# Altium schematic sheet doantk.SchDoc
size A2; SheetNumber: 1; SheetTotal: 1
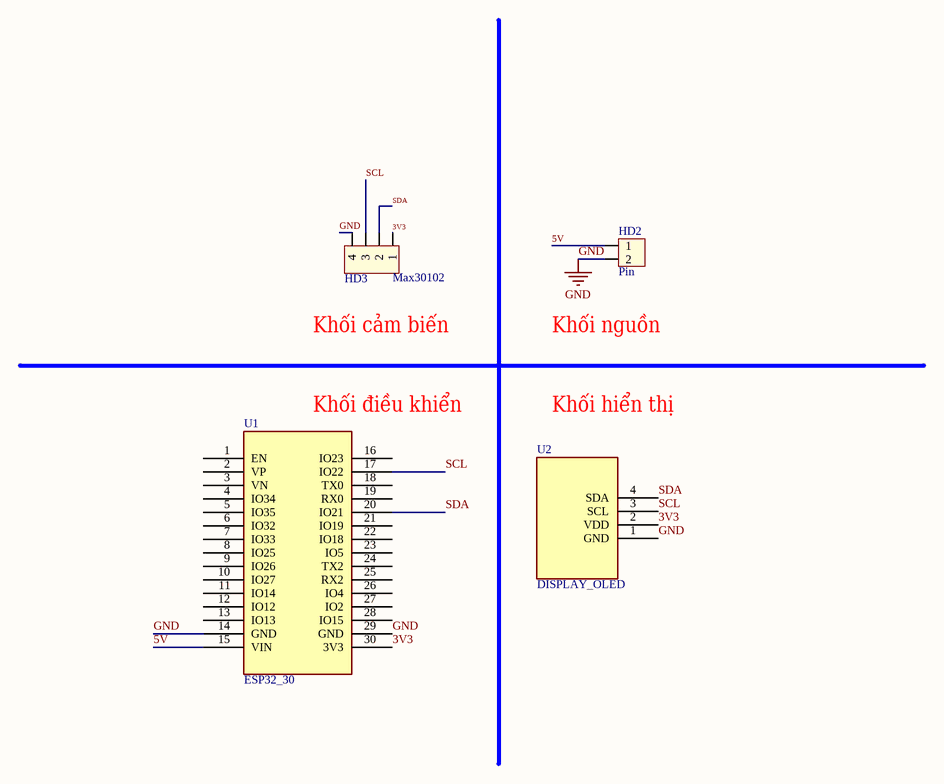
[diagram p0: doantk.SchDoc]

## Parts
HD2  Pin  [HED2]
HD3  Max30102  [HED4]
U1  ESP32_30  [ESP32_30]
U2  DISPLAY_OLED  [DISPLAY_OLED]

## Nets
GND: HD2.2 HD3.4 U1.14(GND) U1.29(GND) U2.1(GND)
3V3: HD3.1 U1.30(3V3) U2.2(VDD)
5V: HD2.1 U1.15(VIN)
SCL: HD3.3 U1.17(IO22) U2.3(SCL)
SDA: HD3.2 U1.20(IO21) U2.4(SDA)

Not connected (* = marked no-connect by the designer): U1 1(EN) 2(VP) 3(VN) 4(IO34) 5(IO35) 6(IO32) 7(IO33) 8(IO25) 9(IO26) 10(IO27) 11(IO14) 12(IO12) 13(IO13) 16(IO23) 18(TX0) 19(RX0) 21(IO19) 22(IO18) 23(IO5) 24(TX2) 25(RX2) 26(IO4) 27(IO2) 28(IO15)

## Notes on the sheet
- Khối cảm biến
- Khối nguồn
- (near U1) Khối điều khiển
- Khối hiển thị

## Library data of the parts
HD2 = Hed2: Header 2 (Green); Value: Header 2
HD3 = Hed4: Header 4 (Green); Value: Header 4
U1 = ESP32_30: Microcontoller Board 30 Pins Wifi 2.4GHz BLE 4.2 ESP32-WROOM-32D; ComponentLink1Description: Datasheet; ComponentLink1URL: https://www.mouser.com/datasheet/2/891/esp32_wroom_32d_esp32_wroom_32u_datasheet_en-1365844.pdf
U2 = DISPLAY_OLED: Display Oled 128x64 0.96" I2C.